# Altium schematic sheet HORLOGE_PLEIADES.SchDoc
size Tabloid; Sheet_Name: Insert name in Document Parameters; Size: 11x17
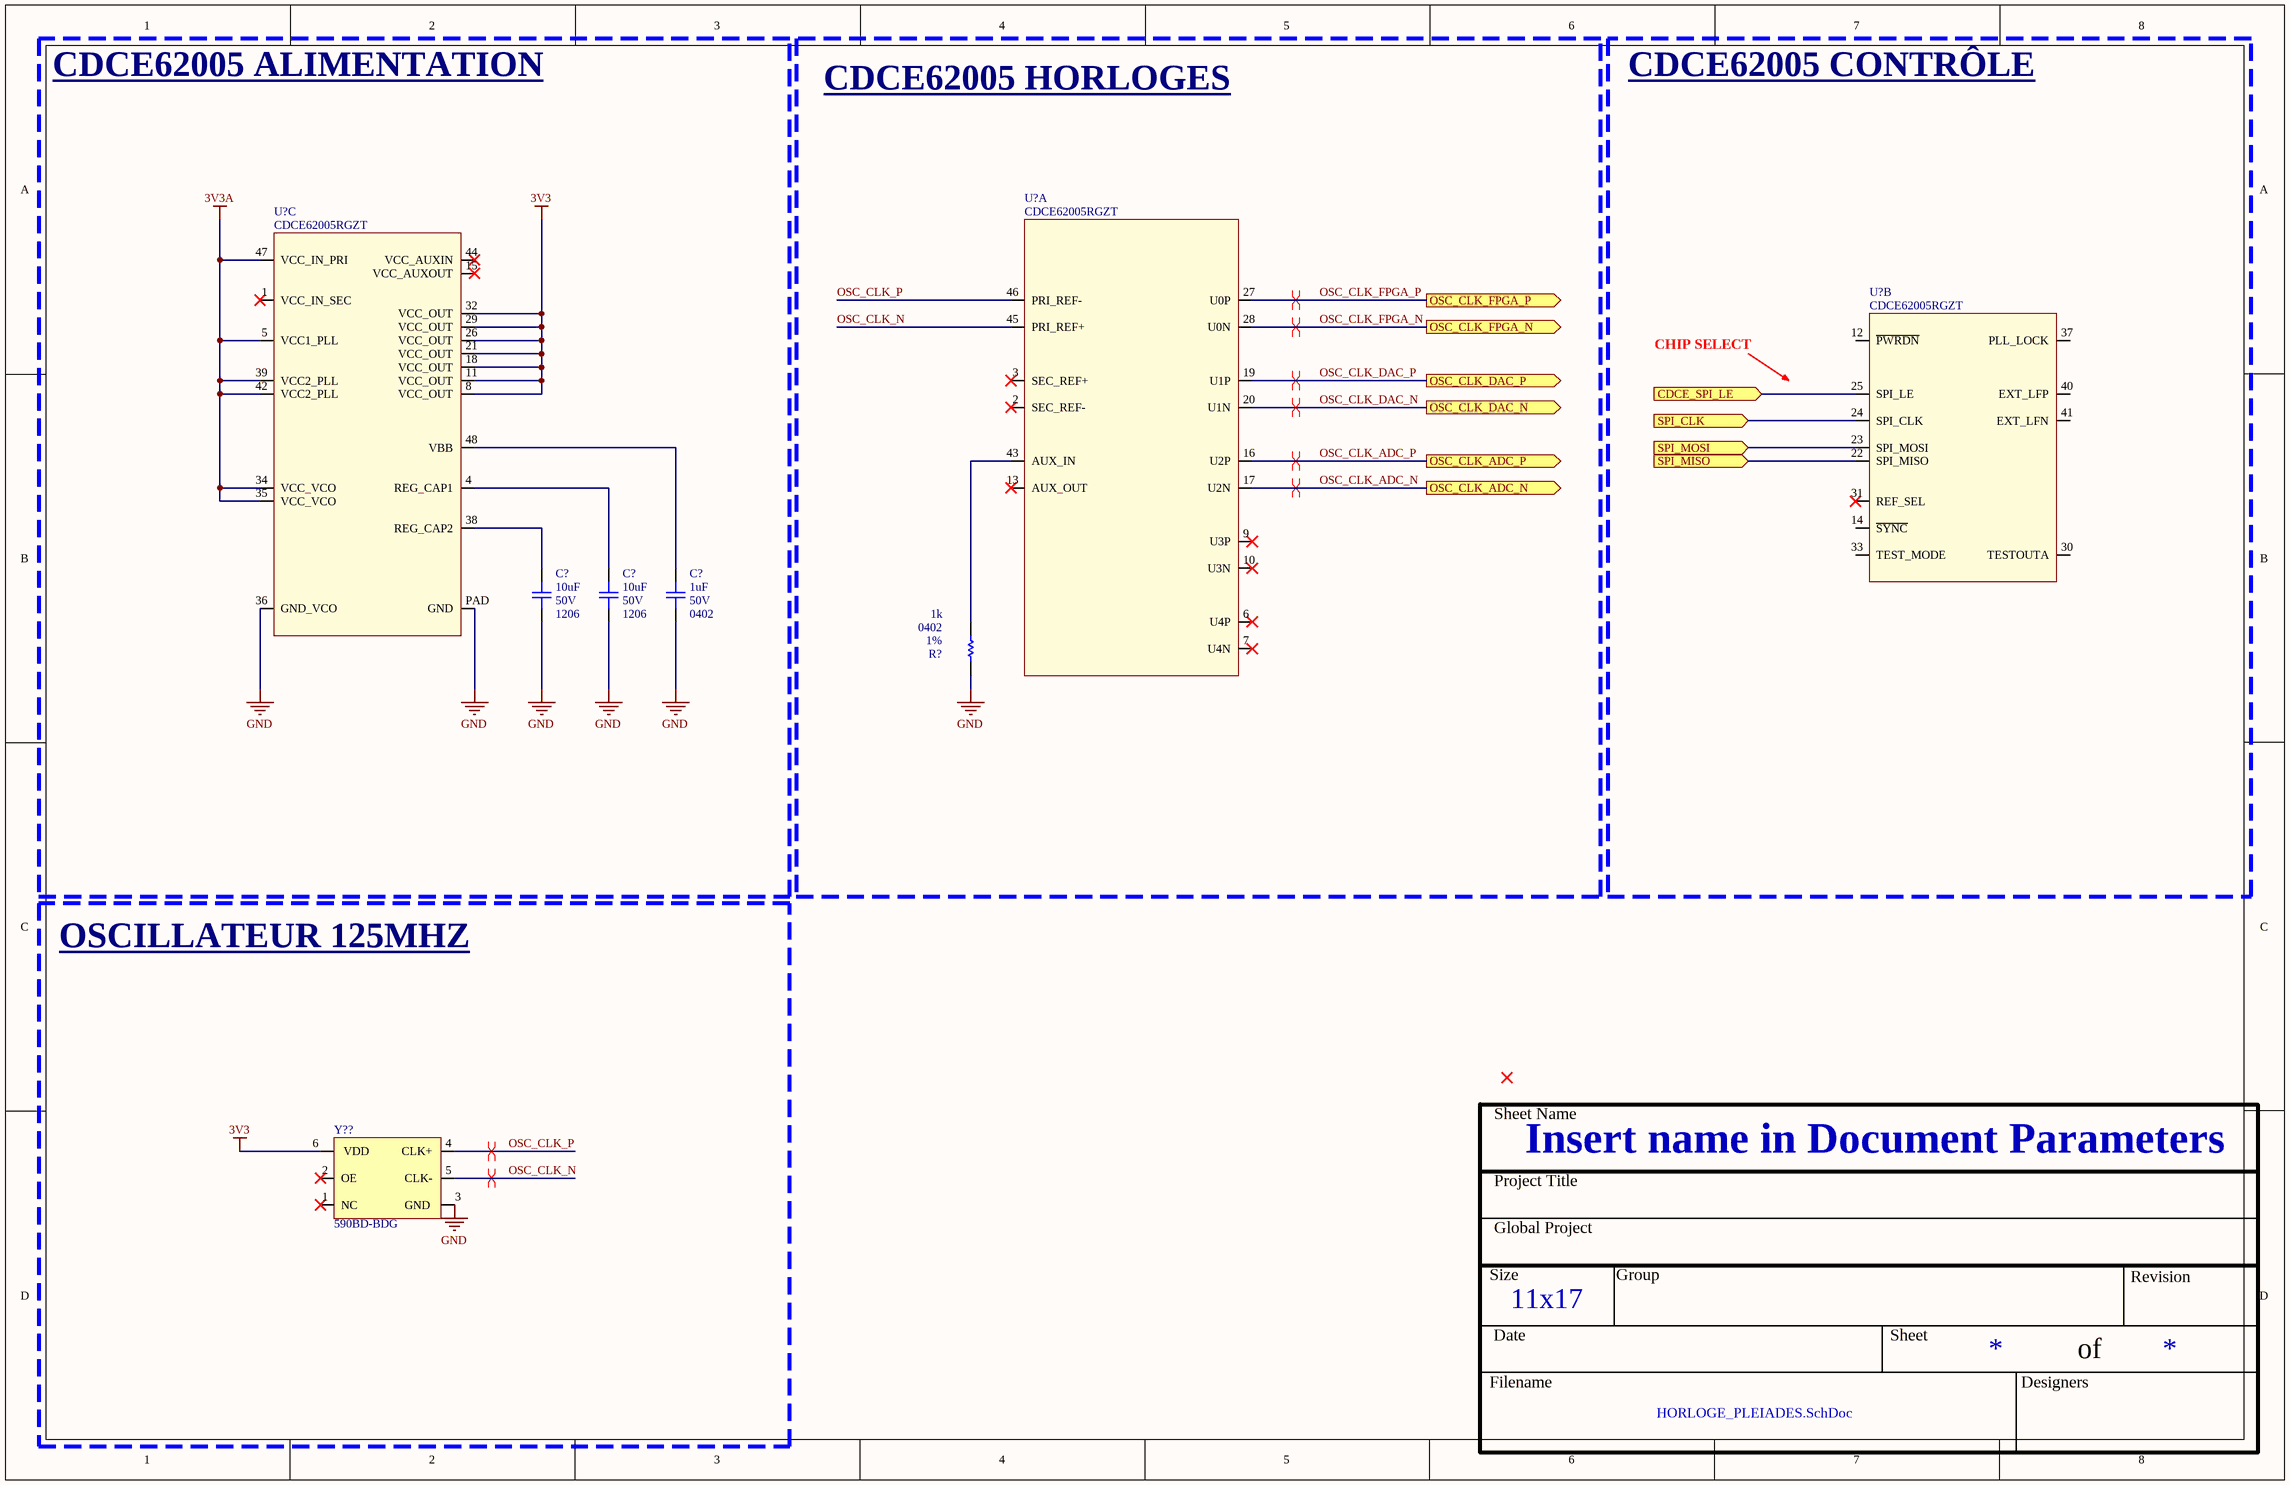
[diagram p0: HORLOGE_PLEIADES.SchDoc]

## Parts
(Parts that share a designator on the sheet are numbered #1, #2 ... from top to bottom, then left to right.)
C?#1  value 10uF  Voltage: 50V  Package: 1206  [CAP_1206]  (hidden comment: CAP - 1206)
C?#2  value 10uF  Voltage: 50V  Package: 1206  [CAP_1206]  (hidden comment: CAP - 1206)
C?#3  value 1uF  Voltage: 50V  Package: 0402  [CAP_1206]  (hidden comment: CAP - 1206)
R?  value 1k  Package: 0402  Precision: 1%  [RES_0402]  (hidden comment: RES - 0402)
U?#1  CDCE62005RGZT  [TIM_CDCE62005RGZT]  (part A of 3)
U?#2  CDCE62005RGZT  [TIM_CDCE62005RGZT]  (part C of 3)
U?#3  CDCE62005RGZT  [TIM_CDCE62005RGZT]  (part B of 3)
Y??  590BD-BDG  [OSC_590BD-BDG]

## Blocks framed on the sheet
CDCE62005 ALIMENTATION: C?#1-C?#3 U?#2
CDCE62005 HORLOGES: R? U?#1
CDCE62005 CONTRÔLE: U?#3
OSCILLATEUR 125MHZ: Y??

## Ports
CDCE_SPI_LE (in), OSC_CLK_ADC_N (out), OSC_CLK_ADC_P (out), OSC_CLK_DAC_N (out), OSC_CLK_DAC_P (out), OSC_CLK_FPGA_N (out), OSC_CLK_FPGA_P (out), SPI_CLK (in), SPI_MISO (in), SPI_MOSI (in)

## Nets
3V3: U?#2.8(VCC_OUT) U?#2.11(VCC_OUT) U?#2.18(VCC_OUT) U?#2.21(VCC_OUT) U?#2.26(VCC_OUT) U?#2.29(VCC_OUT) U?#2.32(VCC_OUT) Y??.6(VDD)
3V3A: U?#2.5(VCC1_PLL) U?#2.34(VCC_VCO) U?#2.35(VCC_VCO) U?#2.39(VCC2_PLL) U?#2.42(VCC2_PLL) U?#2.47(VCC_IN_PRI)
GND: C?#1.1 C?#2.1 C?#3.1 R?.2 U?#2.36(GND_VCO) U?#2.PAD(GND) Y??.3(GND)
CDCE_SPI_LE: U?#3.25(SPI_LE) ; port CDCE_SPI_LE
OSC_CLK_ADC_N: U?#1.17(U2N) ; port OSC_CLK_ADC_N
OSC_CLK_ADC_P: U?#1.16(U2P) ; port OSC_CLK_ADC_P
OSC_CLK_DAC_N: U?#1.20(U1N) ; port OSC_CLK_DAC_N
OSC_CLK_DAC_P: U?#1.19(U1P) ; port OSC_CLK_DAC_P
OSC_CLK_FPGA_N: U?#1.28(U0N) ; port OSC_CLK_FPGA_N
OSC_CLK_FPGA_P: U?#1.27(U0P) ; port OSC_CLK_FPGA_P
OSC_CLK_N: U?#1.45(PRI_REF+) Y??.5(CLK-)
OSC_CLK_P: U?#1.46(PRI_REF-) Y??.4(CLK+)
SPI_CLK: U?#3.24(SPI_CLK) ; port SPI_CLK
SPI_MISO: U?#3.22(SPI_MISO) ; port SPI_MISO
SPI_MOSI: U?#3.23(SPI_MOSI) ; port SPI_MOSI
NetC?#1_2: C?#1.2 U?#2.38(REG_CAP2)
NetC?#2_2: C?#2.2 U?#2.4(REG_CAP1)
NetC?#3_2: C?#3.2 U?#2.48(VBB)
NetR?_1: R?.1 U?#1.43(AUX_IN)

Not connected (* = marked no-connect by the designer): U?#1 2(SEC_REF-)* 3(SEC_REF+)* 6(U4P)* 7(U4N)* 9(U3P)* 10(U3N)* 13(AUX_OUT)*; U?#2 1(VCC_IN_SEC)* 15(VCC_AUXOUT)* 44(VCC_AUXIN)*; U?#3 12(~{PWRDN}) 14(~{SYNC}) 30(TESTOUTA) 31(REF_SEL)* 33(TEST_MODE) 37(PLL_LOCK) 40(EXT_LFP) 41(EXT_LFN); Y?? 1(NC)* 2(OE)*

## Layout directives
differential pair: OSC_CLK_ADC_N, OSC_CLK_ADC_P, OSC_CLK_DAC_N, OSC_CLK_DAC_P, OSC_CLK_FPGA_N, OSC_CLK_FPGA_P, OSC_CLK_N, OSC_CLK_P

## Notes on the sheet
- CHIP SELECT
- Sheet Name
- Project Title
- Global Project
- Size
- Group
- Revision
- Date
- Sheet
- of
- Filename
- Designers

## Library data of the parts
C?#1-C?#3 = CAP - 1206: Precision: 10%; Current: *; CreatedBy: Jonathan Bouchard; Power: *
R? = RES - 0402: Voltage: 50V; Power: 1/16W; Current: *; CreatedBy: Jonathan Bouchard
U?#1-U?#3 = TIM_CDCE62005RGZT: TIM - CLK SYNTH JITTER CLEANER 3:5 - QFN-48; Voltage: 3 V ~ 3.6 V; Mfg: Texas Instruments; Current: *; Power: *; Mfg Part Number: CDCE62005RGZT; HelpURL: http://www.ti.com/lit/ds/symlink/cdce62005.pdf; CreatedBy: Jonathan Bouchard; Temperature: -40°C ~ 85°C; Value: *; Precision: *; Package: QFN-48; Supplier 1: Digikey; Supplier Part Number 1: 296-23947-1-ND
Y?? = OSC_590BD-BDG: TIM - OSC PROG 125MHz ~ 214.999MHz LVDS 3.3V 7PPM EN/DS - 6-SMD; Manufacturer #1: Silicon Labs; Current Rating: 100 mA (supply); Note: Spécifié la fréquence lors de la commande; Voltage rating: 3.3V (supply); Polarized: Yes; Value: ±7ppm (freq Stability), ±20ppm (freq stability total); Magnetic Material: UNKNOWN; GRAMS Lib Spec: 2.8; Manufacturer #2: *; Power Max: *; Part Number #1: 590BD-BDG; Part Number #2: *; HelpURL: https://www.silabs.com/documents/public/data-sheets/Si590-591.pdf; Supplier 1: Digi-Key; Supplier Part Number 1: 590BD-BDG-ND; Assembly Type: SMD; Temperature: -40°C ~ 85°C; Package: 6-SMD; CreatedBy/Date: from 590BD-CDG; Tolerance: *; VerifiedBy: Caroline Paulin / 3/10/2019; Cryo: UNKNOWN